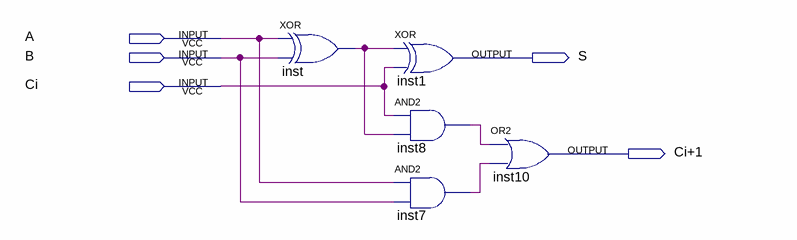
[diagram p0: schematic sheet]
// Quartus schematic 1bitadd.bdf as structural Verilog: 5 symbols, 5 pins
module \1bitadd  (
  input  A,
  input  B,
  input  Ci,
  output S,
  output \Ci+1 
);

  wire inst7_out, inst8_out, inst_out;

  xor inst (inst_out, A, B);
  xor inst1 (S, inst_out, Ci);
  and inst8 (inst8_out, Ci, inst_out);
  and inst7 (inst7_out, A, B);
  or inst10 (\Ci+1 , inst8_out, inst7_out);
endmodule
